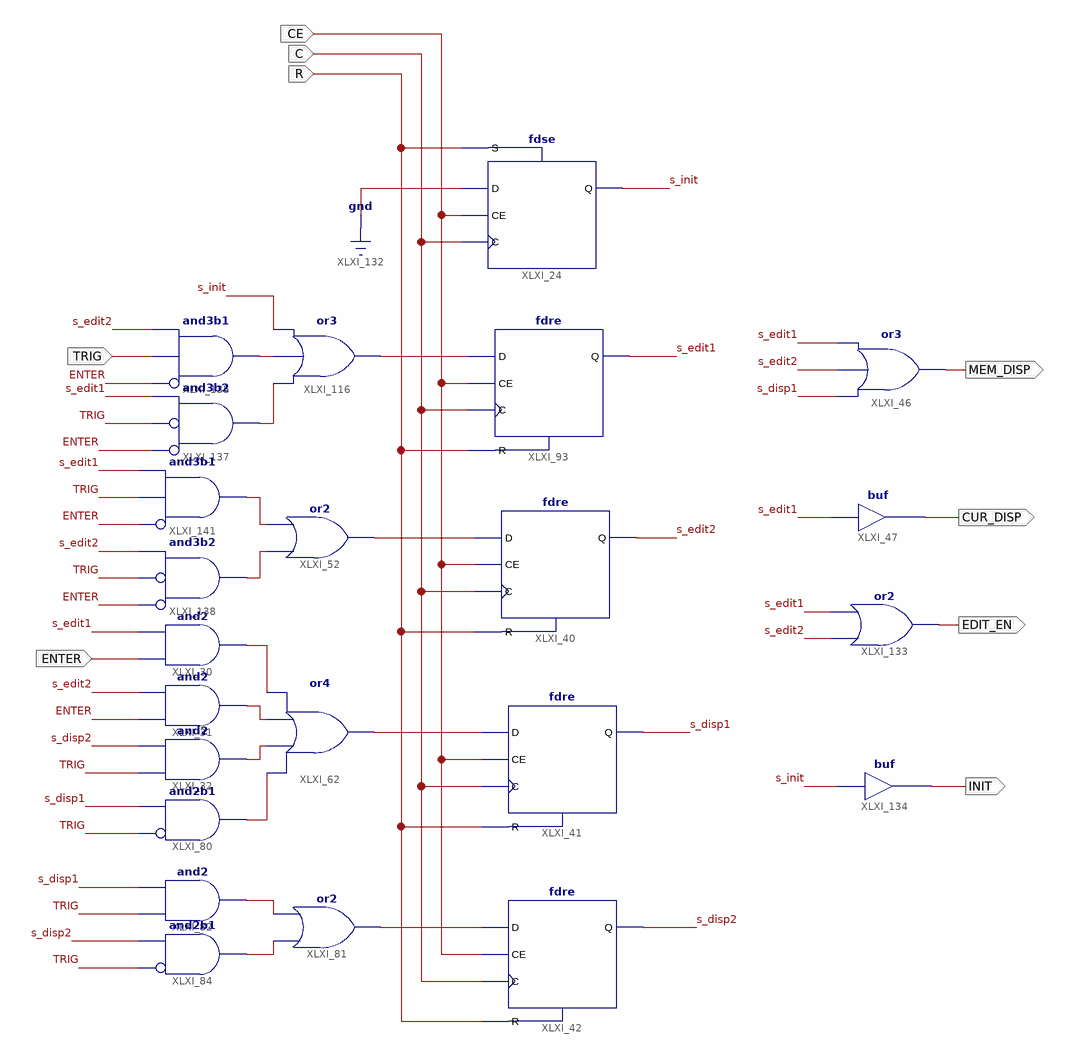
[diagram p0: schematic sheet 1]
// Xilinx ISE schematic controller.sch (spartan6) as structural Verilog: 23 symbols, 9 ports
module controller (
  input  C,
  input  CE,
  input  R,
  input  TRIG,
  input  ENTER,
  output MEM_DISP,
  output CUR_DISP,
  output EDIT_EN,
  output INIT
);

  wire s_disp1, s_disp2, s_edit1, s_edit2, s_init, XLXN_8, XLXN_21, XLXN_22, XLXN_38, XLXN_117, XLXN_118,
       XLXN_173, XLXN_174, XLXN_175, XLXN_176, XLXN_177, XLXN_178, XLXN_283, XLXN_290;

  fdre XLXI_40 (.C(C), .CE(CE), .D(XLXN_8), .R(R), .Q(s_edit2));
  fdre XLXI_41 (.C(C), .CE(CE), .D(XLXN_21), .R(R), .Q(s_disp1));
  fdre XLXI_42 (.C(C), .CE(CE), .D(XLXN_22), .R(R), .Q(s_disp2));
  or XLXI_62 (XLXN_21, XLXN_176, XLXN_175, XLXN_174, XLXN_173);
  or XLXI_81 (XLXN_22, XLXN_178, XLXN_177);
  and XLXI_82 (XLXN_177, TRIG, s_disp1);
  and XLXI_84 (XLXN_178, ~TRIG, s_disp2);  // and2b1
  and XLXI_30 (XLXN_173, ENTER, s_edit1);
  and XLXI_31 (XLXN_174, ENTER, s_edit2);
  and XLXI_32 (XLXN_175, TRIG, s_disp2);
  and XLXI_80 (XLXN_176, ~TRIG, s_disp1);  // and2b1
  or XLXI_46 (MEM_DISP, s_disp1, s_edit2, s_edit1);
  buf XLXI_47 (CUR_DISP, s_edit1);
  fdre XLXI_93 (.C(C), .CE(CE), .D(XLXN_38), .R(R), .Q(s_edit1));
  or XLXI_116 (XLXN_38, XLXN_290, XLXN_283, s_init);
  fdse XLXI_24 (.C(C), .CE(CE), .D(1'b0), .S(R), .Q(s_init));
  or XLXI_133 (EDIT_EN, s_edit2, s_edit1);
  buf XLXI_134 (INIT, s_init);
  and XLXI_135 (XLXN_283, ~ENTER, TRIG, s_edit2);  // and3b1
  and XLXI_137 (XLXN_290, ~ENTER, ~TRIG, s_edit1);  // and3b2
  or XLXI_52 (XLXN_8, XLXN_118, XLXN_117);
  and XLXI_138 (XLXN_118, ~ENTER, ~TRIG, s_edit2);  // and3b2
  and XLXI_141 (XLXN_117, ~ENTER, TRIG, s_edit1);  // and3b1
endmodule
